# EAGLE design Varella_Feature_Board v.1.0 (EAGLE 9.4.2)
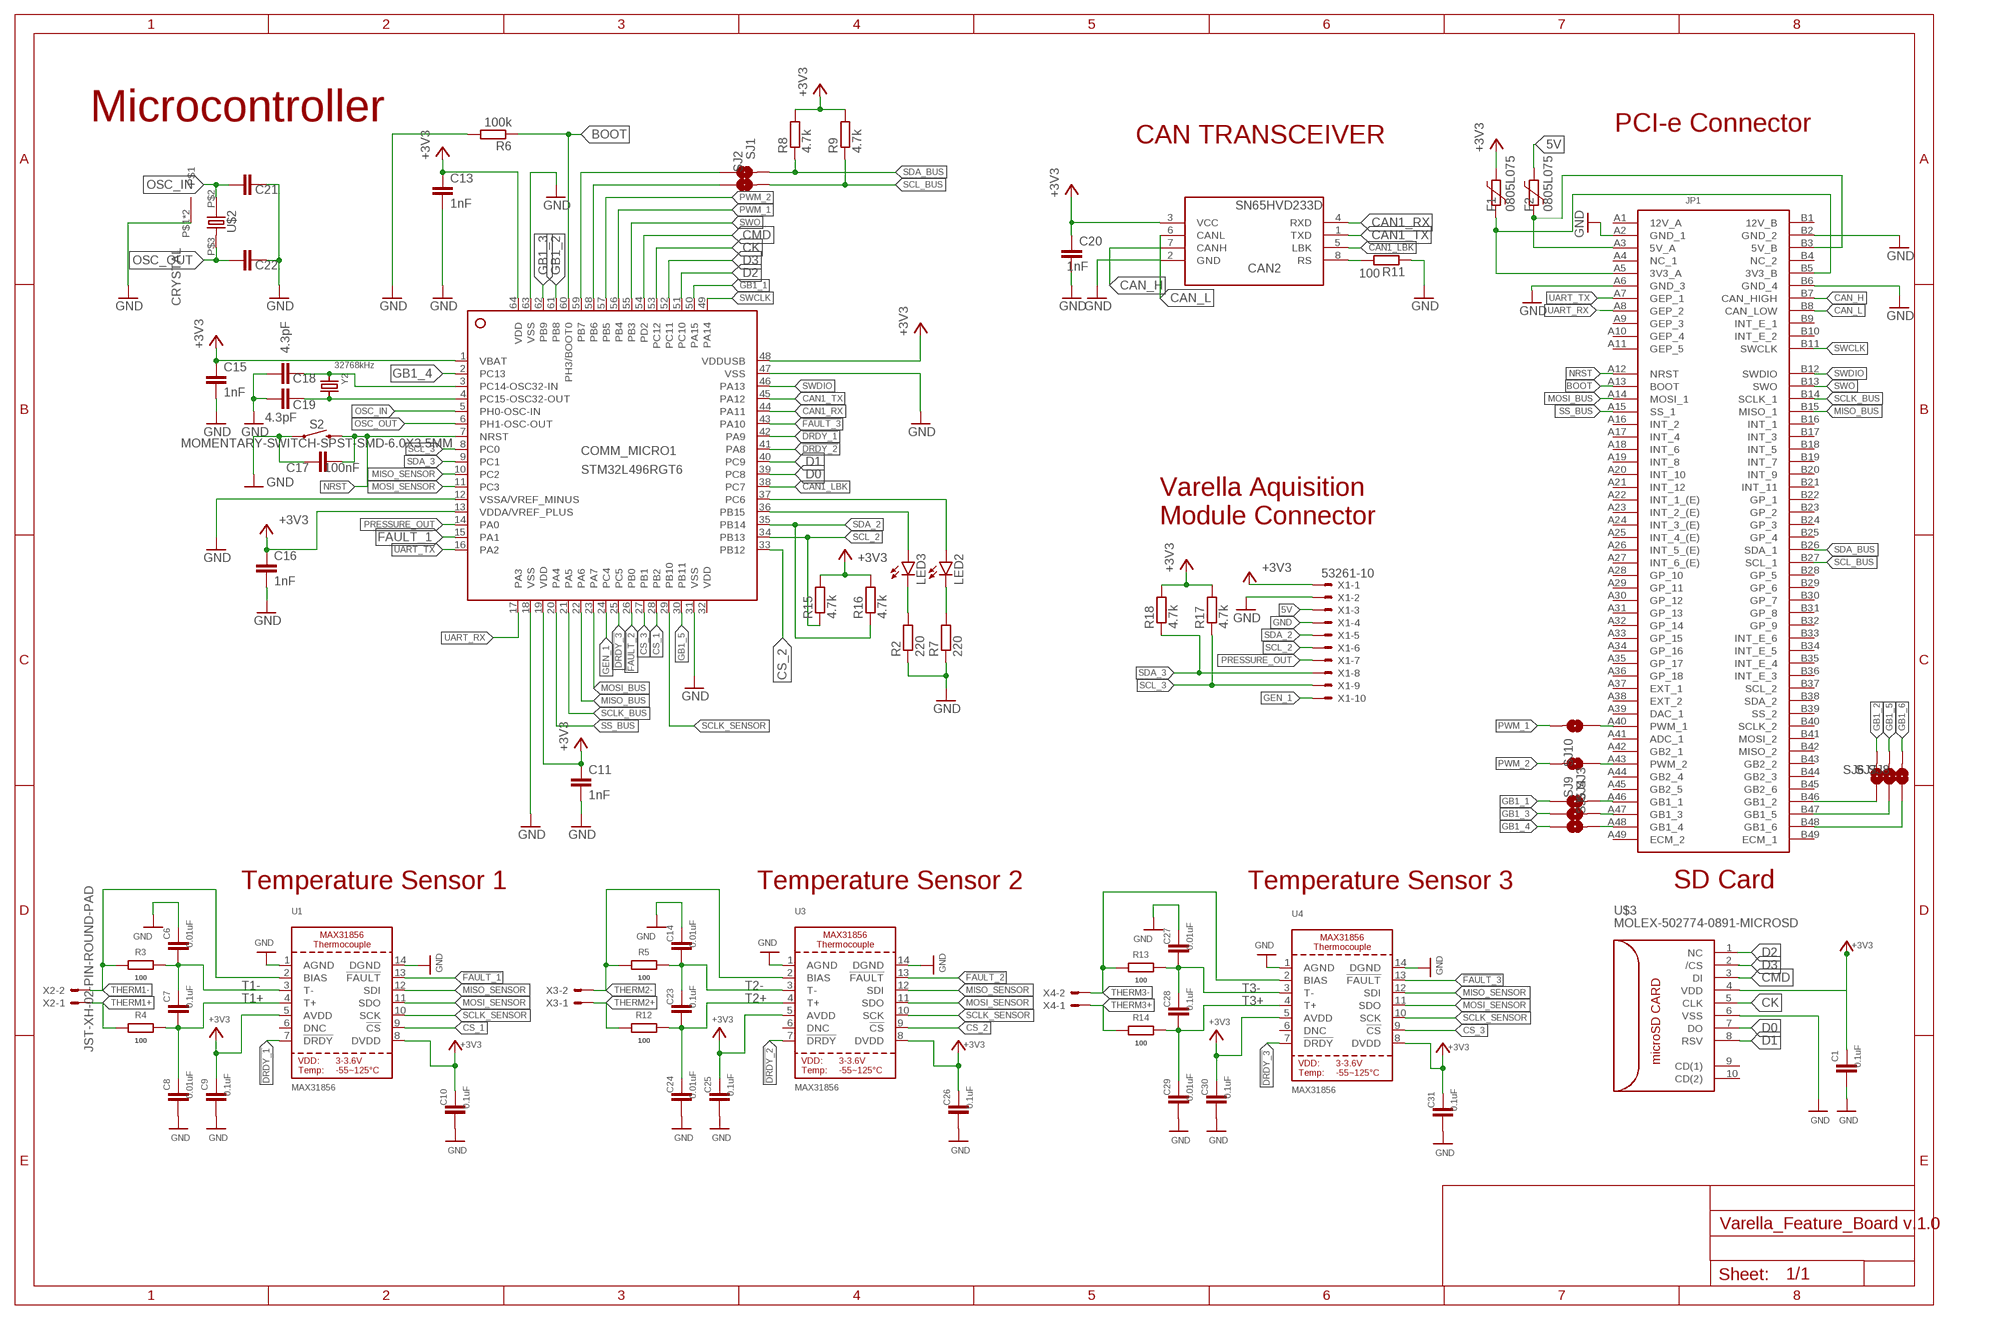
[diagram p0: schematic, sheet 1]

## Parts
C1  0.1uF  C-EUC0805  [C0805]
C6  0.01uF  C-EUC0805  [C0805]
C7  0.1uF  C-EUC0805  [C0805]
C8  0.01uF  C-EUC0805  [C0805]
C9  0.1uF  C-EUC0805  [C0805]
C10  0.1uF  C-EUC0805  [C0805]
C11  1nF  C-EUC0805  [C0805]
C13  1nF  C-EUC0805  [C0805]
C14  0.01uF  C-EUC0805  [C0805]
C15  1nF  C-EUC0805  [C0805]
C16  1nF  C-EUC0805  [C0805]
C17  100nF  C-EUC0805  [C0805]
C18  4.3pF  C-EUC0805  [C0805]
C19  4.3pF  C-EUC0805  [C0805]
C20  1nF  C-EUC0805  [C0805]
C21  C-EUC0805  [C0805]
C22  C-EUC0805  [C0805]
C23  0.1uF  C-EUC0805  [C0805]
C24  0.01uF  C-EUC0805  [C0805]
C25  0.1uF  C-EUC0805  [C0805]
C26  0.1uF  C-EUC0805  [C0805]
C27  0.01uF  C-EUC0805  [C0805]
C28  0.1uF  C-EUC0805  [C0805]
C29  0.01uF  C-EUC0805  [C0805]
C30  0.1uF  C-EUC0805  [C0805]
C31  0.1uF  C-EUC0805  [C0805]
CAN2  SN65HVD233D  [SOIC8]
COMM_MICRO1  STM32L496RGT6  [LQFP64_10X10]
F1  0805L075  [0805L]
F2  0805L075  [0805L]
JP1  FEATURE_BOARD  [PCI-E_164_EDGE]
LED2  LEDCHIP-LED0805  [CHIP-LED0805]
LED3  LEDCHIP-LED0805  [CHIP-LED0805]
R2  220  R-EU_R0805  [R0805]
R3  100  R-EU_R0805  [R0805]
R4  100  R-EU_R0805  [R0805]
R5  100  R-EU_R0805  [R0805]
R6  100k  R-EU_R0805  [R0805]
R7  220  R-EU_R0805  [R0805]
R8  4.7k  R-EU_R0805  [R0805]
R9  4.7k  R-EU_R0805  [R0805]
R11  100  R-EU_R0805  [R0805]
R12  100  R-EU_R0805  [R0805]
R13  100  R-EU_R0805  [R0805]
R14  100  R-EU_R0805  [R0805]
R15  4.7k  R-EU_R0805  [R0805]
R16  4.7k  R-EU_R0805  [R0805]
R17  4.7k  R-EU_R0805  [R0805]
R18  4.7k  R-EU_R0805  [R0805]
S2  MOMENTARY-SWITCH-SPST-SMD-6.0X3.5MM  [TACTILE_SWITCH_SMD_6.0X3.5MM]
SJ1  SMD-JUMPER-2  [SMD-JUMPER-2]
SJ2  SMD-JUMPER-2  [SMD-JUMPER-2]
SJ3  SMD-JUMPER-2  [SMD-JUMPER-2]
SJ4  SMD-JUMPER-2  [SMD-JUMPER-2]
SJ5  SMD-JUMPER-2  [SMD-JUMPER-2]
SJ6  SMD-JUMPER-2  [SMD-JUMPER-2]
SJ7  SMD-JUMPER-2  [SMD-JUMPER-2]
SJ8  SMD-JUMPER-2  [SMD-JUMPER-2]
SJ9  SMD-JUMPER-2  [SMD-JUMPER-2]
SJ10  SMD-JUMPER-2  [SMD-JUMPER-2]
U1  MAX31856  [TSSOP14]
U3  MAX31856  [TSSOP14]
U4  MAX31856  [TSSOP14]
U$2  CRYSTAL  [CRYSTAL_SMD]
U$3  MOLEX-502774-0891-MICROSD  [MOLEX-502774-0891-MICROSD]
X1  53261-10  [53261-10]
X2  JST-XH-02-PIN-ROUND-PAD  [JST-XH-02-PACKAGE-ROUND-PAD]
X3  JST-XH-02-PIN-ROUND-PAD  [JST-XH-02-PACKAGE-ROUND-PAD]
X4  JST-XH-02-PIN-ROUND-PAD  [JST-XH-02-PACKAGE-ROUND-PAD]
Y2  32768kHz  CRYSTAL8X3.8SMT  [CRYSTAL_8X3.8]

## Nets
3.3V: C9.1 C10.1 C25.1 C26.1 C30.1 C31.1 U1.5(AVDD) U1.8(DVDD) U3.5(AVDD) U3.8(DVDD) U4.5(AVDD) U4.8(DVDD) ; supply symbol labelled +3V3
5V: F2.1 X1.3
!DRDY_1: COMM_MICRO1.42(PA9) U1.7(!DRDY)
!DRDY_2: COMM_MICRO1.41(PA8) U3.7(!DRDY)
!DRDY_3: COMM_MICRO1.25(PC5) U4.7(!DRDY)
!FAULT_1: COMM_MICRO1.15(PA1) U1.13(!FAULT)
!FAULT_2: COMM_MICRO1.26(PB0) U3.13(!FAULT)
!FAULT_3: COMM_MICRO1.43(PA10) U4.13(!FAULT)
+3V3: C1.1 C11.1 C13.1 C15.1 C16.1 C20.1 CAN2.3(VCC) COMM_MICRO1.1(VBAT) COMM_MICRO1.13(VDDA/VREF_PLUS) COMM_MICRO1.19(VDD) COMM_MICRO1.48(VDDUSB) COMM_MICRO1.64(VDD) F1.1 R8.2 R9.2 R15.2 R16.2 R17.2 R18.2 U$3.4(VDD) X1.1
BOOT: COMM_MICRO1.60(PH3/BOOT0) JP1.A13(BOOT) R6.1
CAN1_LBK: CAN2.5(LBK) COMM_MICRO1.38(PC7)
CAN1_RX: CAN2.4(RXD) COMM_MICRO1.44(PA11)
CAN1_TX: CAN2.1(TXD) COMM_MICRO1.45(PA12)
CAN_H: CAN2.7(CANH) JP1.B7(CAN_HIGH)
CAN_L: CAN2.6(CANL) JP1.B8(CAN_LOW)
CK: COMM_MICRO1.53(PC12) U$3.5(CLK)
CMD: COMM_MICRO1.54(PD2) U$3.3(DI)
CS_1: COMM_MICRO1.28(PB2) U1.9(!CS)
CS_2: COMM_MICRO1.33(PB12) U3.9(!CS)
CS_3: COMM_MICRO1.27(PB1) U4.9(!CS)
D0: COMM_MICRO1.39(PC8) U$3.7(DO)
D1: COMM_MICRO1.40(PC9) U$3.8(RSV)
D2: COMM_MICRO1.51(PC10) U$3.1(NC)
D3: COMM_MICRO1.52(PC11) U$3.2(/CS)
GB1_1: COMM_MICRO1.50(PA15) SJ3.1
GB1_2: COMM_MICRO1.61(PB8) SJ6.2
GB1_3: COMM_MICRO1.62(PB9) SJ4.1
GB1_4: COMM_MICRO1.2(PC13) SJ5.1
GB1_5: COMM_MICRO1.30(PB11) SJ7.2
GB1_6: SJ8.2
GEN_1: COMM_MICRO1.24(PC4) X1.10
GND: C1.2 C6.1 C8.2 C9.2 C10.2 C11.2 C13.2 C14.1 C15.2 C16.2 C17.1 C18.1 C19.1 C20.2 C21.2 C22.2 C24.2 C25.2 C26.2 C27.1 C29.2 C30.2 C31.2 CAN2.2(GND) COMM_MICRO1.12(VSSA/VREF_MINUS) COMM_MICRO1.18(VSS) COMM_MICRO1.31(VSS) COMM_MICRO1.47(VSS) COMM_MICRO1.63(VSS) JP1.A2(GND_1) JP1.A6(GND_3) JP1.B2(GND_2) R2.1 R6.2 R7.1 R11.1 S2.1 U1.1(AGND) U1.14(DGND) U3.1(AGND) U3.14(DGND) U4.1(AGND) U4.14(DGND) U$2.P$1 U$2.P$4 U$3.6(VSS) X1.2 X1.4
GND(6): JP1.B6(GND_4) ; supply symbol labelled GND
MISO_BUS: COMM_MICRO1.22(PA6) JP1.B15(MISO_1)
MISO_SENSOR: COMM_MICRO1.10(PC2) U1.12(SDI) U3.12(SDI) U4.12(SDI)
MOSI_BUS: COMM_MICRO1.23(PA7) JP1.A14(MOSI_1)
MOSI_SENSOR: COMM_MICRO1.11(PC3) U1.11(SDO) U3.11(SDO) U4.11(SDO)
N$1: JP1.A40(PWM_1) JP1.A43(PWM_2) SJ9.1 SJ10.1
N$2: JP1.A47(GB1_3) SJ4.2
N$3: COMM_MICRO1.36(PB15) LED3.A
N$4: LED3.C R2.2
N$5: F2.2 JP1.A3(5V_A) JP1.B3(5V_B)
N$6: COMM_MICRO1.37(PC6) LED2.A
N$7: LED2.C R7.2
N$8: F1.2 JP1.A5(3V3_A) JP1.B5(3V3_B)
N$9: JP1.B46(GB1_2) SJ6.1
N$10: C18.2 COMM_MICRO1.3(PC14-OSC32-IN) Y2.P$1
N$11: C19.2 COMM_MICRO1.4(PC15-OSC32-OUT) Y2.P$4
N$12: COMM_MICRO1.59(PB7) SJ1.1
N$13: COMM_MICRO1.58(PB6) SJ2.1
N$14: CAN2.8(RS) R11.2
N$15: JP1.B47(GB1_5) SJ7.1
N$16: JP1.B48(GB1_6) SJ8.1
N$17: JP1.A48(GB1_4) SJ5.2
N$20: JP1.A46(GB1_1) SJ3.2
NRST: C17.2 COMM_MICRO1.7(NRST) JP1.A12(NRST) S2.2
OSC_IN: C21.1 COMM_MICRO1.5(PH0-OSC-IN) U$2.P$2
OSC_OUT: C22.1 COMM_MICRO1.6(PH1-OSC-OUT) U$2.P$3
PRESSURE_OUT: COMM_MICRO1.14(PA0) X1.7
PWM_1: COMM_MICRO1.56(PB4) SJ10.2
PWM_2: COMM_MICRO1.57(PB5) SJ9.2
SCL_2: COMM_MICRO1.34(PB13) R15.1 X1.6
SCL_3: COMM_MICRO1.8(PC0) R17.1 X1.9
SCL_BUS: JP1.B27(SCL_1) R9.1 SJ2.2
SCLK_BUS: COMM_MICRO1.21(PA5) JP1.B14(SCLK_1)
SCLK_SENSOR: COMM_MICRO1.29(PB10) U1.10(SCK) U3.10(SCK) U4.10(SCK)
SDA_2: COMM_MICRO1.35(PB14) R16.1 X1.5
SDA_3: COMM_MICRO1.9(PC1) R18.1 X1.8
SDA_BUS: JP1.B26(SDA_1) R8.1 SJ1.2
SS_BUS: COMM_MICRO1.20(PA4) JP1.A15(SS_1)
SWCLK: COMM_MICRO1.49(PA14) JP1.B11(SWCLK)
SWDIO: COMM_MICRO1.46(PA13) JP1.B12(SWDIO)
SWO: COMM_MICRO1.55(PB3) JP1.B13(SWO)
T1+: C7.2 C8.1 R4.2 U1.4(T+)
T1-: C6.2 C7.1 R3.2 U1.3(T-)
T2+: C23.2 C24.1 R12.2 U3.4(T+)
T2-: C14.2 C23.1 R5.2 U3.3(T-)
T3+: C28.2 C29.1 R14.2 U4.4(T+)
T3-: C27.2 C28.1 R13.2 U4.3(T-)
THERM1+: R4.1 X2.1
THERM1-: R3.1 U1.2(BIAS) X2.2
THERM2+: R12.1 X3.1
THERM2-: R5.1 U3.2(BIAS) X3.2
THERM3+: R14.1 X4.1
THERM3-: R13.1 U4.2(BIAS) X4.2
UART_RX: COMM_MICRO1.17(PA3) JP1.A8(GEP_2)
UART_TX: COMM_MICRO1.16(PA2) JP1.A7(GEP_1)
Unconnected: JP1.A4(NC_1) JP1.A9(GEP_3) JP1.A10(GEP_4) JP1.A11(GEP_5) JP1.A16(INT_2) JP1.A17(INT_4) JP1.A18(INT_6) JP1.A19(INT_8) JP1.A20(INT_10) JP1.A21(INT_12) JP1.A22(INT_1_(E)) JP1.A23(INT_2_(E)) JP1.A24(INT_3_(E)) JP1.A25(INT_4_(E)) JP1.A26(INT_5_(E)) JP1.A27(INT_6_(E)) JP1.A28(GP_10) JP1.A29(GP_11) JP1.A30(GP_12) JP1.A31(GP_13) JP1.A32(GP_14) JP1.A33(GP_15) JP1.A34(GP_16) JP1.A35(GP_17) JP1.A36(GP_18) JP1.A37(EXT_1) JP1.A38(EXT_2) JP1.A39(DAC_1) JP1.A41(ADC_1) JP1.A42(GB2_1) JP1.A44(GB2_4) JP1.A45(GB2_5) JP1.A49(ECM_2) JP1.B4(NC_2) JP1.B9(INT_E_1) JP1.B10(INT_E_2) JP1.B16(INT_1) JP1.B17(INT_3) JP1.B18(INT_5) JP1.B19(INT_7) JP1.B20(INT_9) JP1.B21(INT_11) JP1.B22(GP_1) JP1.B23(GP_2) JP1.B24(GP_3) JP1.B25(GP_4) JP1.B28(GP_5) JP1.B29(GP_6) JP1.B30(GP_7) JP1.B31(GP_8) JP1.B32(GP_9) JP1.B33(INT_E_6) JP1.B34(INT_E_5) JP1.B35(INT_E_4) JP1.B36(INT_E_3) JP1.B37(SCL_2) JP1.B38(SDA_2) JP1.B39(SS_2) JP1.B40(SCLK_2) JP1.B41(MOSI_2) JP1.B42(MISO_2) JP1.B43(GB2_2) JP1.B44(GB2_3) JP1.B45(GB2_6) JP1.B49(ECM_1) U1.6(DNC) U3.6(DNC) U4.6(DNC) U$3.9(CD(1)) U$3.10(CD(2))

## Notes on the sheet
- Microcontroller
- CAN TRANSCEIVER | PCI-e Connector
- Varella Aquisition 
  Module Connector
- Temperature Sensor 1 | Temperature Sensor 2 | Temperature Sensor 3 | SD Card

## Power pins joined to a net without a drawn wire
12V_A: JP1.A1(12V_A)
12V_B: JP1.B1(12V_B)
VDD: COMM_MICRO1.32(VDD)

## Library data of the parts
C1 C6-C11 C13-C31 = rcl:C-EU: CAPACITOR, European symbol; SPICEPREFIX: C
CAN2 = SN65HVD233D:SN65HVD233D; AVAILABILITY: Unavailable; DESCRIPTION: 3.3V CAN Transceiver with Standby Mode, Loop-back 8-SOIC -40 to 125; MF: Texas Instruments; MP: SN65HVD233D; PACKAGE: SOIC-8 Texas Instruments; PRICE: None
COMM_MICRO1 = STM32L4xxx:STM32L496R*: STM32L496RX LQFP64 Cortex M4, 80MHz, 512kB-1024kB Flash, 320kB SRAM Datasheet STM32L496XX <http://www.st.com/content/ccc/resource/technical/document/datasheet/group3/3f/73/19/d1/d4/9e/48/34/DM00284211/files/DM00284211.pdf/jcr:content/translations/en.DM00284211.pdf>; FARNELL: 2725138; FLASH: 1024kB; SRAM: 320kB
F1 F2 = polyfuse-smd_10:?: Polyfuse Resettable PTC Source: http://www.littelfuse.com/products/resettable-ptcs.aspx; MF: Littelfuse; MPN: 0805L075; OC_FARNELL: 1832105RL; OC_NEWARK: 18M4777
JP1 = Genus_Feature_Board:FEATURE_BOARD
LED2 LED3 = led:LED: LED OSRAM: - CHIPLED LG R971, LG N971, LY N971, LG Q971, LY Q971, LO R971, LY R971 LH N974, LH R974 LS Q976, LO Q976, LY Q976 LO Q996 - Hyper CHIPLED LW Q18S LB Q993, LB Q99A, LB R99A - SideLED LS A670, LO A670, LY A670, LG A670, LP A670 LB A673, LV A673, LT A673, LW A673 LH A674 LY A675 LS A676, LA A676, LO A676, LY A676, LW A676 LS A679, LY A679, LG A679 - Hyper Micro SIDELED® LS Y876, LA Y876, LO Y876, LY Y876 LT Y87S - SmartLED LW L88C, LW L88S LB L89C, LB L89S, LG L890 LS L89K, LO L89K, LY L89K LS L896, LA L896, LO L896, LY L896 - TOPLED LS T670, LO T670, LY T670, LG T670, LP T670 LSG T670, LSP T670, LSY T670, LOP T670, LYG T670 LG T671, LOG T671, LSG T671 LB T673, LV T673, LT T673, LW T673 LH T674 LS T676, LA T676, LO T676, LY T676, LB T676, LH T676, LSB T676, LW T676 LB T67C, LV T67C, LT T67C, LS T67K, LO T67K, LY T67K, LW E67C LS E67B, LA E67B, LO E67B, LY E67B, LB E67C, LV E67C, LT E67C LW T67C LS T679, LY T679, LG T679 LS T770, LO T770, LY T770, LG T770, LP T770 LB T773, LV T773, LT T773, LW T773 LH T774 LS E675, LA E675, LY E675, LS T675 LS T776, LA T776, LO T776, LY T776, LB T776 LHGB T686 LT T68C, LB T68C - Hyper Mini TOPLED® LB M676 - Mini TOPLED Santana® LG M470 LS M47K, LO M47K, LY M47K Source: http://www.osram.convergy.de LUXEON: - LUMILED® LXK2-PW12-R00, LXK2-PW12-S00, LXK2-PW14-U00, LXK2-PW14-V00 LXK2-PM12-R00, LXK2-PM12-S00, LXK2-PM14-U00 LXK2-PE12-Q00, LXK2-PE12-R00, LXK2-PE12-S00, LXK2-PE14-T00, LXK2-PE14-U00 LXK2-PB12-K00, LXK2-PB12-L00, LXK2-PB12-M00, LXK2-PB14-N00, LXK2-PB14-P00, LXK2-PB14-Q00 LXK2-PR12-L00, LXK2-PR12-M00, LXK2-PR14-Q00, LXK2-PR14-R00 LXK2-PD12-Q00, LXK2-PD12-R00, LXK2-PD12-S00 LXK2-PH12-R00, LXK2-PH12-S00 LXK2-PL12-P00, LXK2-PL12-Q00, LXK2-PL12-R00 Source: www.luxeon.com KINGBRIGHT: KA-3528ASYC Source: www.kingbright.com
R2-R9 R11-R18 = rcl:R-EU_: RESISTOR, European symbol; SPICEPREFIX: R
S2 = SparkFun-Switches:MOMENTARY-SWITCH-SPST: Momentary Switch (Pushbutton) - SPST Normally-open (NO) SPST momentary switches (buttons, pushbuttons). Variants PTH-12MM - 12mm square, through-hole Momentary Pushbutton Switch - 12mm Square <https://www.sparkfun.com/products/9190> (COM-09190) PTH-6.0MM, PTH-6.0MM-KIT - 6.0mm square, through-hole Mini Pushbutton Switch <https://www.sparkfun.com/products/97> (COM-00097) KIT package intended for soldering kit's - only one side of pads' copper is exposed. PTH-RIGHT-ANGLE-KIT - Right-angle, through-hole Right Angle Tactile Button <https://www.sparkfun.com/products/10791> - Used on SparkFun BigTime Watch Kit <https://www.sparkfun.com/products/11734> SMD-12MM - 12mm square, surface-mount Tactile Button - SMD (12mm) <https://www.sparkfun.com/products/12993> (COM-12993) Used on SparkFun PicoBoard <https://www.sparkfun.com/products/11888> SMD-4.5MM - 4.5mm Square Trackball Switch Used on SparkFun Blackberry Trackballer Breakout <https://www.sparkfun.com/products/13169> SMD-4.6MMX2.8MM - 4.60mm x 2.80mm, surface mount Used on SparkFun SAMD21 Mini Breakout <https://www.sparkfun.com/products/13664> SMD-5.2MM, SMD-5.2-REDUNDANT - 5.2mm square, surface-mount Mini Pushbutton Switch - SMD <https://www.sparkfun.com/products/8720> (COM-08720) Used on Arduino Pro Mini <https://www.sparkfun.com/products/11114> REDUNDANT package connects both switch circuits together SMD-6.0X3.5MM - 6.0 x 3.5mm, surface mount Momentary Reset Switch SMD <https://www.sparkfun.com/products/8229> (COM-08229) SMD-6.2MM-TALL - 6.2mm square, surface mount Tactile Button - SMD (6mm) <https://www.sparkfun.com/products/12992> Used on SparkFun Digital Sandbox <https://www.sparkfun.com/products/12651> SMD-RIGHT-ANGLE - Right-angle, surface mount Used on SparkFun Block for Intel® Edison - Arduino <https://www.sparkfun.com/products/13036>; PROD_ID: SWCH-00815; SF_SKU: COM-08229
SJ1-SJ10 = FaBo-PIN:SMD-JUMPER-2
U1 U3 U4 = microbuilder:MAX31856: MAX31856 - Thermocouple Sensor ADC
U$2 = cristal:CRYSTAL
U$3 = Ava:MOLEX-502774-0891-MICROSD; FARNELL: 2064063
X1 = con-zenith:53?-10: CONNECTOR wire to board 1.25 mm (.049 inch) pitch header; MF: MOLEX; OC_FARNELL: unknown; OC_NEWARK: unknown
X2-X4 = JST-XH-Zenith:JST-XH-02-PIN: JST XH Connector 2 Pin Wire to board connector. Pitch: 2,54 mm, (0.100") Number of pins: 2 Created by Rembrandt Electronics www.rembrandtelectronics.com
Y2 = microbuilder:CRYSTAL: Crystals HC49UP - Surface Mount Crystal 4.0MHz 18pF +/-30ppm Surface Mount Crystal [Digikey: 535-9857-1-ND] 12.0 MHz Surface Mount Crystal [Digikey: 535-9869-6-ND] 25.0 MHz Surface Mount Crystal [Digikey: 535-9078-1-ND] 2.5 x 2.0mm - MEMs SMT Crystal 16.0 MHz 10pF 20ppm 2.5 x 2.0mm Crystal [Digikey -40-85°C: 535-10923-1-ND] 3.2 x 2.5mm - MEMs SMT Crystal 12.0 MHz 8pF 15ppm 3.2 x 2.5mm Crystal [Digikey: -10-70°C: 644-1047-1-ND -40-125°C: 644-1128-1-ND] 16.0 MHz 8pF 15ppm 3.2 x 2.5mm Crystal [Digikey: -10-70°C: 644-1049-1-ND -40-125°C: 644-1129-2-ND] 16.0 MHz 10pF 10ppm 3.2 x 2.5mm Crystal [Digikey: 644-1100-1-ND] 27.12 MHz 18pF 30ppm 3.2 x 2.5mm Crystal [Digikey: 887-1424-1-ND] 27.12MHz 10pF 10ppm 3.2 x 2.5mm Crystal [Digikey: 887-1329-1-ND] 4.9 x 1.8mm - MEMs SMT Crystal 32.768 KHz 12.5pF 20ppm 4.9 x 1.8mm Crystal [Digikey: SE2415CT-ND] 8.0 x 3.8mm - Surface Mount Crystal 32.768kHz 12.5pF 20ppm -40°C-85°C [Digikey: 535-9166-2-ND] Cylinder 32.768KHz Cylinder Crystal (2x6mm body) [Ex. Digikey: 300-8341-2-ND]

## Board
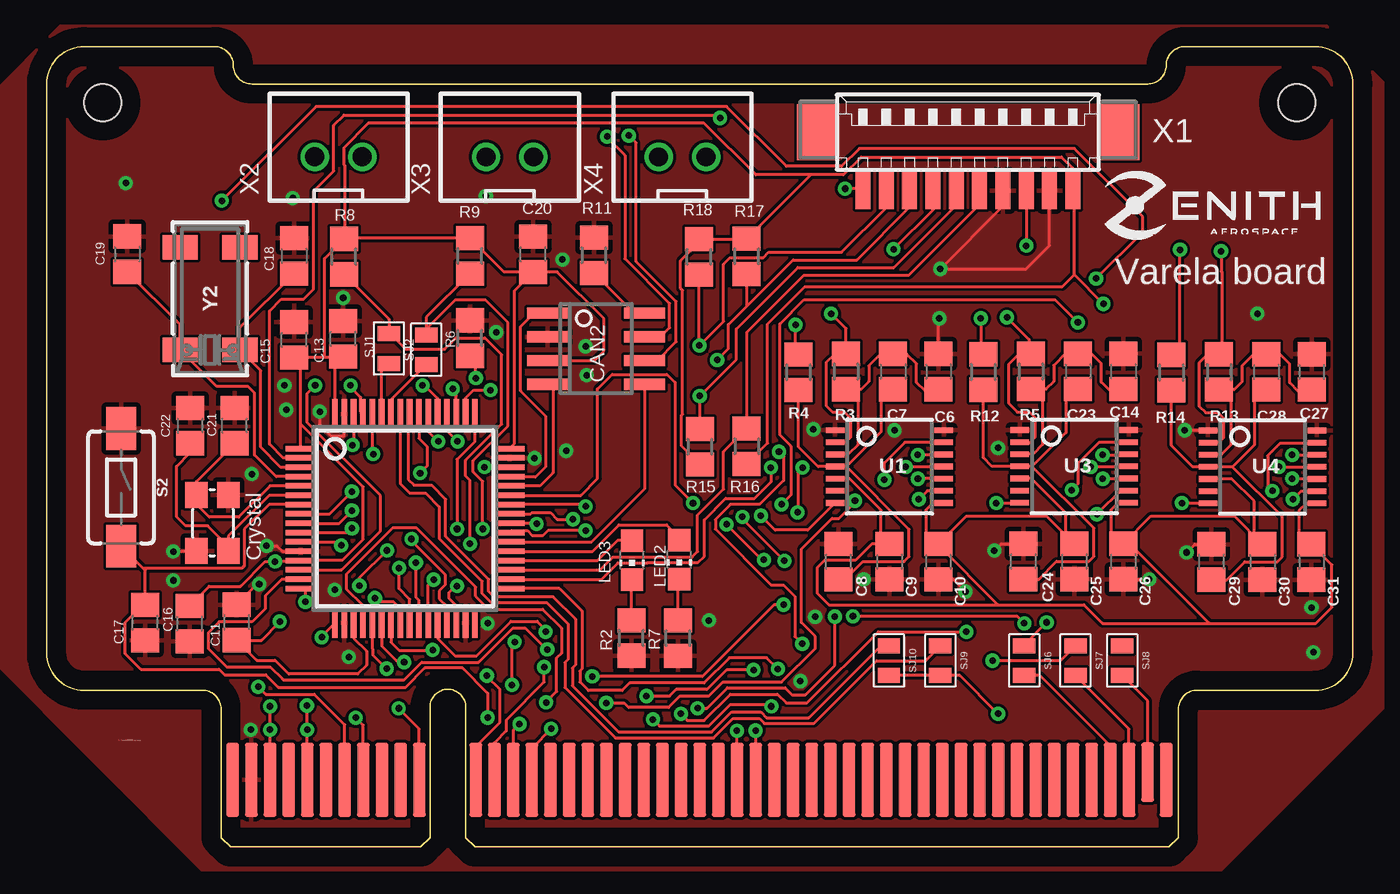
[diagram p1: board, top side]
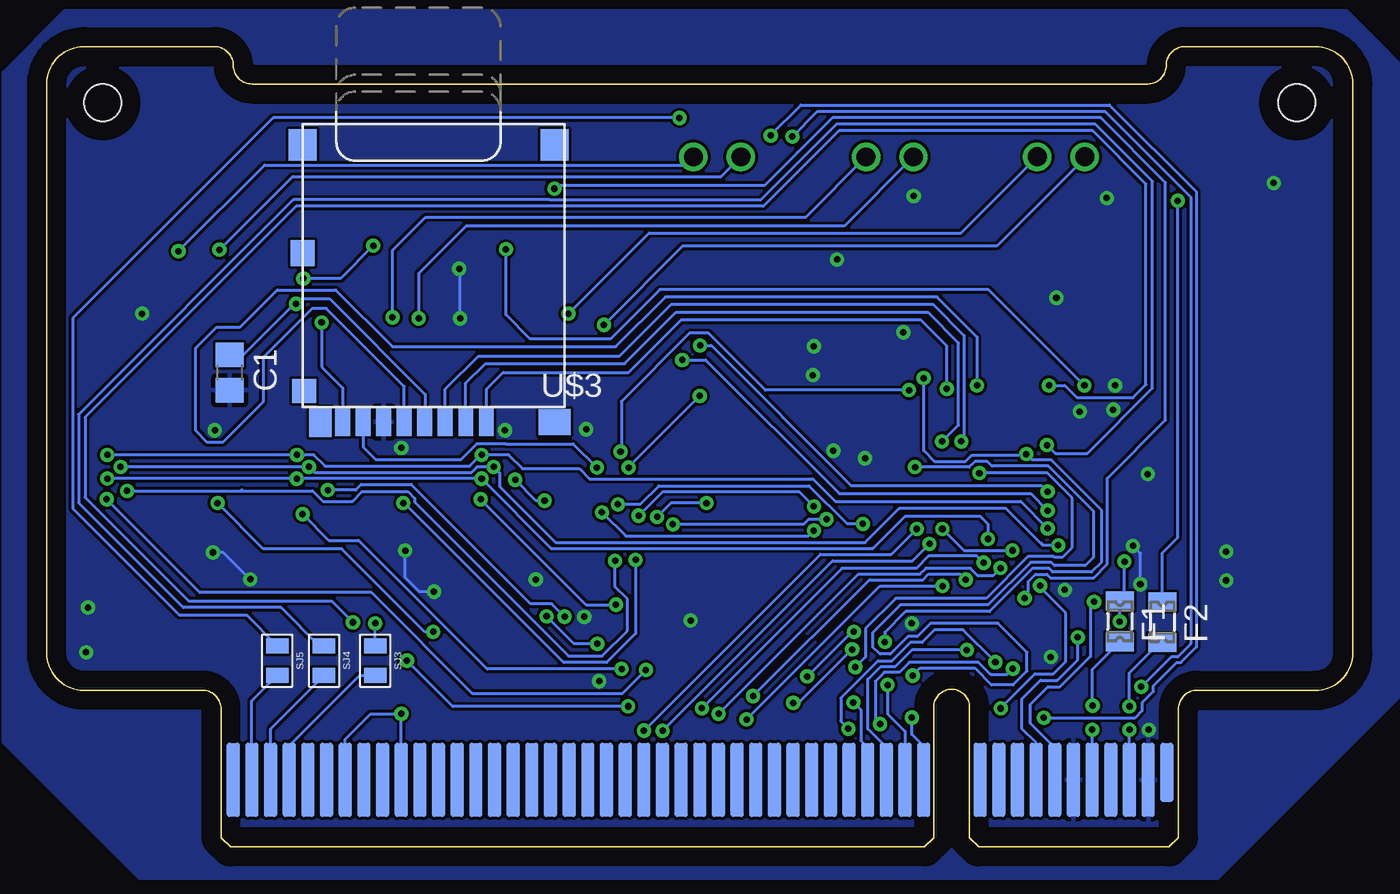
[diagram p2: board, bottom side, seen from below]

Size 70 x 42.9 mm. Coordinates in mm from the lower left corner, seen from the top.
Copper layers (1*16): Top 0.035mm / dielectric 1.5mm / Bottom 0.035mm
Design rules "default": minimum track width 6mil, minimum drill 0.35mm, track to track 6mil, track to pad 6mil, pad to pad 6mil, via to via 6mil, smd to smd 6mil, copper to edge 40mil, drill to drill 6mil, minimum pad ring 10mil, minimum via ring 8mil, stop-mask expansion 4mil, vias tented up to drill 0mil, thermal gap 10mil

### Footprints (pad centres in the part's own frame; a part is rotated, then mirrored left to right if it is on the bottom)
C0805 = smd 1.3 x 1.5: 1 -0.95,0; 2 0.95,0
SOIC8 = smd 0.6 x 2.2: 1 -1.905,-2.6; 2 -0.635,-2.6; 3 0.635,-2.6; 4 1.905,-2.6; 5 1.905,2.6; 6 0.635,2.6; 7 -0.635,2.6; 8 -1.905,2.6
LQFP64_10X10 = smd 0.3 x 1.6: 1 -3.75,-5.6; 2 -3.25,-5.6; 3 -2.75,-5.6; 4 -2.25,-5.6; 5 -1.75,-5.6; 6 -1.25,-5.6; 7 -0.75,-5.6; 8 -0.25,-5.6; 9 0.25,-5.6; 10 0.75,-5.6; 11 1.25,-5.6; 12 1.75,-5.6; 13 2.25,-5.6; 14 2.75,-5.6; 15 3.25,-5.6; 16 3.75,-5.6; 33 3.75,5.6; 34 3.25,5.6; 35 2.75,5.6; 36 2.25,5.6; 37 1.75,5.6; 38 1.25,5.6; 39 0.75,5.6; 40 0.25,5.6; 41 -0.25,5.6; 42 -0.75,5.6; 43 -1.25,5.6; 44 -1.75,5.6; 45 -2.25,5.6; 46 -2.75,5.6; 47 -3.25,5.6; 48 -3.75,5.6 | smd 1.6 x 0.3: 17 5.6,-3.75; 18 5.6,-3.25; 19 5.6,-2.75; 20 5.6,-2.25; 21 5.6,-1.75; 22 5.6,-1.25; 23 5.6,-0.75; 24 5.6,-0.25; 25 5.6,0.25; 26 5.6,0.75; 27 5.6,1.25; 28 5.6,1.75; 29 5.6,2.25; 30 5.6,2.75; 31 5.6,3.25; 32 5.6,3.75; 49 -5.6,3.75; 50 -5.6,3.25; 51 -5.6,2.75; 52 -5.6,2.25; 53 -5.6,1.75; 54 -5.6,1.25; 55 -5.6,0.75; 56 -5.6,0.25; 57 -5.6,-0.25; 58 -5.6,-0.75; 59 -5.6,-1.25; 60 -5.6,-1.75; 61 -5.6,-2.25; 62 -5.6,-2.75; 63 -5.6,-3.25; 64 -5.6,-3.75
0805L = smd 1 x 1.5: 1 -1.1,0; 2 1.1,0
PCI-E_164_EDGE = smd 0.7 x 3.2 bottom: A1 0.62,4 | smd 0.7 x 4 bottom: A2 1.62,3.6; A3 2.62,3.6; A4 3.62,3.6; A5 4.62,3.6; A6 5.62,3.6; A7 6.62,3.6; A8 7.62,3.6; A9 8.62,3.6; A10 9.62,3.6; A11 10.62,3.6; A12 13.65,3.6; A13 14.65,3.6; A14 15.65,3.6; A15 16.65,3.6; A16 17.65,3.6; A17 18.65,3.6; A18 19.65,3.6; A19 20.65,3.6; A20 21.65,3.6; A21 22.65,3.6; A22 23.65,3.6; A23 24.65,3.6; A24 25.65,3.6; A25 26.65,3.6; A26 27.65,3.6; A27 28.65,3.6; A28 29.65,3.6; A29 30.65,3.6; A30 31.65,3.6; A31 32.65,3.6; A32 33.65,3.6; A33 34.65,3.6; A34 35.65,3.6; A35 36.65,3.6; A36 37.65,3.6; A37 38.65,3.6; A38 39.65,3.6; A39 40.65,3.6; A40 41.65,3.6; A41 42.65,3.6; A42 43.65,3.6; A43 44.65,3.6; A44 45.65,3.6; A45 46.65,3.6; A46 47.65,3.6; A47 48.65,3.6; A48 49.65,3.6; A49 50.65,3.6 | smd 0.7 x 4: B1 0.62,3.6; B2 1.62,3.6; B3 2.62,3.6; B4 3.62,3.6; B5 4.62,3.6; B6 5.62,3.6; B7 6.62,3.6; B8 7.62,3.6; B9 8.62,3.6; B10 9.62,3.6; B11 10.62,3.6; B12 13.65,3.6; B13 14.65,3.6; B14 15.65,3.6; B15 16.65,3.6; B16 17.65,3.6; B17 18.65,3.6; B18 19.65,3.6; B19 20.65,3.6; B20 21.65,3.6; B21 22.65,3.6; B22 23.65,3.6; B23 24.65,3.6; B24 25.65,3.6; B25 26.65,3.6; B26 27.65,3.6; B27 28.65,3.6; B28 29.65,3.6; B29 30.65,3.6; B30 31.65,3.6; B31 32.65,3.6; B32 33.65,3.6; B33 34.65,3.6; B34 35.65,3.6; B35 36.65,3.6; B36 37.65,3.6; B37 38.65,3.6; B38 39.65,3.6; B39 40.65,3.6; B40 41.65,3.6; B41 42.65,3.6; B42 43.65,3.6; B43 44.65,3.6; B44 45.65,3.6; B45 46.65,3.6; B46 47.65,3.6; B47 48.65,3.6; B49 50.65,3.6 | smd 0.7 x 3.2: B48 49.65,4.01 | hole 2: -6.35,39.9; 57.65,39.9
CHIP-LED0805 = smd 1.2 x 1.2: A 0,-1.05; C 0,1.05
R0805 = smd 1.3 x 1.5: 1 -0.95,0; 2 0.95,0
TACTILE_SWITCH_SMD_6.0X3.5MM = smd 2.3 x 1.6: 1 -3.15,0; 2 3.15,0
SMD-JUMPER-2 = smd 0.8 x 1.2: 1 -0.8,0; 2 0.8,0
TSSOP14 = smd 0.305 x 0.991: 1 -1.95,-2.918; 2 -1.3,-2.918; 3 -0.65,-2.918; 4 0,-2.918; 5 0.65,-2.918; 6 1.3,-2.918; 7 1.95,-2.918; 8 1.95,2.918; 9 1.3,2.918; 10 0.65,2.918; 11 0,2.918; 12 -0.65,2.918; 13 -1.3,2.918; 14 -1.95,2.918
CRYSTAL_SMD = smd 1.4 x 1.2: P$1 0,1.7; P$2 3,1.7; P$3 0,0; P$4 3,0
MOLEX-502774-0891-MICROSD = smd 0.8 x 1.5: 1 -3.3,8.2; 2 -2.2,8.2; 3 -1.1,8.2; 4 0,8.2; 5 1.1,8.2; 6 2.2,8.2; 7 3.3,8.2; 8 4.4,8.2 | smd 1.29 x 1.3: 9 6.455,6.55 | smd 1.29 x 1.4: 10 6.54,-0.85 | smd 1.5 x 1.7: 11 6.54,-6.65; 12 -6.96,-6.65 | smd 1.7 x 1.4: 14 -6.96,8.2 | smd 1.2 x 1.6: 15 5.6,8.2
53261-10 = smd 0.8 x 2: 1 5.625,-2.5; 2 4.375,-2.5; 3 3.125,-2.5; 4 1.875,-2.5; 5 0.625,-2.5; 6 -0.625,-2.5; 7 -1.875,-2.5; 8 -3.125,-2.5; 9 -4.375,-2.5; 10 -5.625,-2.5 | smd 2.1 x 3: S1 8.125,0.625; S2 -8.125,0.625
JST-XH-02-PACKAGE-ROUND-PAD = drill 1.016: 1 -1.27,0; 2 1.27,0
CRYSTAL_8X3.8 = smd 1.3 x 1.9: P$1 -2.75,-1.6; P$2 2.75,-1.6; P$3 2.75,1.6; P$4 -2.75,1.6

### Placement (x,y rotation side)
C1  60.2,25.43 270 bottom
C6  47.8,25.48 270 top
C7  45.37,25.48 270 top
C8  42.44,15.29 90 top
C9  45.17,15.29 270 top
C10  47.79,15.29 270 top
C11  10.19,12.04 90 top
C13  15.89,27.23 90 top
C14  57.7,25.49 270 top
C15  13.26,27.19 90 top
C16  7.65,11.97 270 top
C17  5.28,12.03 90 top
C18  13.27,31.69 270 top
C19  4.32,31.78 270 top
C20  26.07,31.77 90 top
C21  10.07,22.59 90 top
C22  7.7,22.59 90 top
C23  55.27,25.49 270 top
C24  52.34,15.3 90 top
C25  55.07,15.3 270 top
C26  57.69,15.3 270 top
C27  67.79,25.46 270 top
C28  65.36,25.46 270 top
C29  62.43,15.27 90 top
C30  65.16,15.27 270 top
C31  67.78,15.27 270 top
CAN2  29.45,26.71 270 top
COMM_MICRO1  19.2,17.61 270 top
F1  12.49,12.09 270 bottom
F2  10.21,12.06 270 bottom
JP1  9.35,0 0 top
LED2  33.9,15.4 180 top
LED3  31.37,15.38 180 top
R2  31.33,11.2 90 top
R3  42.84,25.48 270 top
R4  40.28,25.45 270 top
R5  52.74,25.49 270 top
R6  22.68,27.28 90 top
R7  33.84,11.2 90 top
R8  15.93,31.64 90 top
R9  22.68,31.69 90 top
R11  29.32,31.71 270 top
R12  50.19,25.46 270 top
R13  62.83,25.46 270 top
R14  60.27,25.43 270 top
R15  35,21.45 270 top
R16  37.52,21.48 270 top
R17  34.96,31.63 90 top
R18  37.51,31.66 90 top
S2  3.99,19.27 270 top
SJ1  18.34,26.71 90 top
SJ2  20.34,26.65 90 top
SJ3  52.39,9.99 270 bottom
SJ4  55.14,9.99 270 bottom
SJ5  57.64,9.99 270 bottom
SJ6  52.39,9.99 90 top
SJ7  55.14,9.99 90 top
SJ8  57.64,9.99 90 top
SJ9  47.89,9.99 90 top
SJ10  45.14,9.99 90 top
U1  45.17,20.39 270 top
U3  55.07,20.4 270 top
U4  65.16,20.38 270 top
U$2  9.74,15.86 90 top
U$3  49.74,30.99 180 bottom
X1  49.37,37.69 0 top
X2  15.64,37 0 top
X3  24.82,36.99 0 top
X4  34.07,36.99 0 top
Y2  8.76,29.39 90 top

### Tracks (layer width: path | path; a pad name or v marks a point on that pad's centre or on a via)
3.3V
  Top 0.152: U1.5 42.26,19.75 43.02,19.75 44.72,18.05 44.72,16.29 44.77,16.24 C9.1 44.22,16.24 43.34,15.36 41.69,15.36 41.29,14.96 41.29,13.61 41.91,12.99 50.99,12.99 | U1.8 47.51,18.44 47.12,18.05 47.12,16.74 | 47.12,16.74 47.12,16.4 | U3.5 52.16,19.76 52.77,19.76 54.62,17.91 54.62,16.3 54.67,16.25 C25.1 53.59,17.74 49.28,17.74 C10.1 | U3.8 57.41,18.45 57.02,18.06 57.02,16.41 57.18,16.25 C26.1 | U4.5 62.25,19.73 63.51,19.73 64.71,18.54 64.71,16.27 64.76,16.22 C30.1 63.65,17.74 59.18,17.74 C26.1 | U4.8 67.5,18.43 67.11,18.04 67.11,16.89 | 67.11,16.89 67.11,16.38 | C26.1 58.05,16.25 62.31,11.99 | 50.99,12.99 47.79,16.19 C10.1 | 50.99,12.99 55.59,12.99 56.59,11.99 62.31,11.99 | 67.11,16.89 C31.1 68.87,15.13 68.87,12.85 68.01,11.99 62.31,11.99 | C10.1 47.61,16.24 47.12,16.74
5V  (via drill 0.35)
  Top 0.152: X1.3 v52.5,32.23 | 9.34,34.59 v9.39,34.64 14.44,39.69 36.44,39.69 39.64,36.49 42.59,36.49 43.54,37.44 55.09,37.44 58.74,33.79 58.74,32.97 v56.24,30.47
  Bottom 0.152: F2.1 10.21,15.77 9.39,16.59 v9.39,34.64 | v52.5,32.23 54.26,30.47 v56.24,30.47
!DRDY_1  (via drill 0.35)
  Top 0.152: U1.7 40.79,16.99 39.04,16.99 v38.27,17.75 | COMM_MICRO1.42 28.79,18.36 v28.89,18.26
  Bottom 0.152: v38.27,17.75 36.97,19.05 29.69,19.05 v28.89,18.26
!DRDY_2  (via drill 0.35)
  Top 0.152: COMM_MICRO1.41 25.94,17.86 26.01,17.92 27,17.92 27.36,17.57 v28.2,17.57 | v38.44,15.39 38.34,15.39 v36.44,17.29 | v50.89,18.44 50.9,18.45 U3.7
  Bottom 0.152: v28.2,17.57 29.16,17.57 29.44,17.29 v36.44,17.29 | v38.44,15.39 38.44,11.44 39.99,9.89 42.29,9.89 50.84,18.44 v50.89,18.44
!DRDY_3  (via drill 0.35)
  Top 0.152: COMM_MICRO1.25 19.45,13.28 18.88,13.85 v18.88,14.95 | v33.99,7.14 34.34,6.79 35.24,6.79 36.64,8.19 39.16,8.19 39.64,7.71 40.74,7.71 44.56,11.54 v49.29,11.54 | v60.84,18.44 62.23,18.44 U4.7
  Bottom 0.152: v18.88,14.95 19.3,14.54 20.1,14.54 20.49,14.93 22.89,14.93 23.19,14.63 26.49,14.63 v33.99,7.14 | v49.29,11.54 49.74,11.54 54.19,15.99 58.39,15.99 v60.84,18.44
!FAULT_1  (via drill 0.35)
  Top 0.152: U1.13 45.99,21.69 44.89,20.59 v44.89,19.69 | v26.83,10.59 26.79,10.59 25.64,11.74 24.98,11.74 23.14,9.9 20.1,9.9 19.15,8.95 12.68,8.95 12.64,8.99 12.64,9 11.99,9.65 9.65,9.65 8.66,10.64 8.66,11.48 9.24,12.07 11.01,12.07 11.71,12.76 11.71,13.46 12.6,14.36 COMM_MICRO1.15 | v29.99,7.72 30.94,7.72 31.19,7.47 33.34,7.47 33.95,8.09 35.49,8.09 36.24,8.84 39.39,8.84 41.19,10.64 41.19,11.29 40.44,12.04 40.44,15.97 42.09,17.62 42.47,17.62 43.36,18.51 v43.32,18.56
  Bottom 0.152: v26.83,10.59 29.73,7.69 29.92,7.69 29.96,7.72 v29.99,7.72 | 43.42,18.56 v43.32,18.56 43.76,18.56 v44.89,19.69
!FAULT_2  (via drill 0.35)
  Top 0.152: COMM_MICRO1.26 19.95,13.22 19.79,13.39 v19.79,15.24 | v54.94,19.13 55.29,19.48 55.29,20.59 56.4,21.7 U3.13 | v34.89,7.44 35.39,7.44 36.48,8.53 39.57,8.53 39.94,8.16 40.66,8.16 42.24,9.74 v42.24,12.34
  Bottom 0.152: v19.79,15.24 20.14,15.59 22.74,15.59 23.39,14.94 27.39,14.94 v34.89,7.44 | v42.24,12.34 42.93,13.04 44.07,13.04 50.46,19.43 53.14,19.43 53.44,19.13 v54.94,19.13
!FAULT_3  (via drill 0.35)
  Top 0.152: COMM_MICRO1.43 28.63,18.86 29.52,19.74 29.52,24.55 30.3,25.33 33.24,25.33 33.68,24.9 33.68,19.4 v34.64,18.44 | v65.69,19.09 65.66,19.09 65.43,19.32 65.43,20.98 66.08,21.62 68.03,21.62 U4.13 | v39.54,15.34 37.29,17.59 v37.29,17.7
  Bottom 0.152: v65.69,19.09 59.59,19.09 | 59.59,19.09 59.54,19.14 | 59.59,19.09 55.75,19.09 55.19,18.53 53.61,18.53 53.1,19.04 50.64,19.04 50.28,18.69 50.28,18.48 42.03,10.24 40.23,10.24 38.88,11.59 38.88,13.29 39.54,13.95 v39.54,15.34 | v34.64,18.44 36.55,18.44 v37.29,17.7
+3V3  (via drill 0.35)
  Top 0.152: 37.49,20.5 R16.2 38.64,21.65 38.64,28.04 40.64,30.04 54.43,30.04 55.07,30.68 | R17.2 37.49,32.58 R18.2 37.54,32.64 37.56,32.64 40.95,36.03 | C11.1 | C16.1 8.71,13.98 10.39,13.98 11.72,15.3 v12.24,15.3 13.55,15.3 COMM_MICRO1.13 13.62,15.38 15.85,15.38 16.97,16.5 16.97,19.3 13.6,22.67 | C11.1 11.26,10.01 12.24,10.01 12.97,9.28 16.68,9.28 17.14,9.74 17.14,10.5 16.45,11.19 COMM_MICRO1.19 | COMM_MICRO1.1 13.6,22.67 | 15.84,26.24 C13.1 16.31,26.29 | 15.84,26.24 14.89,26.24 | 14.89,26.24 C15.1 13.6,25.9 13.6,22.67 | 15.84,26.24 15.45,25.85 COMM_MICRO1.64 | COMM_MICRO1.48 25.05,21.61 25.05,29.8 C20.1 | CAN2.3 29.35,26.07 29.86,26.59 29.86,28.31 27.36,30.82 26.14,30.82 | 26.14,30.82 C20.1 | 26.06,30.74 26.14,30.82 | R17.2 34.96,32.79 | v56.64,29.11 55.07,30.68 | 55.07,30.68 55.07,35.26 X1.1 55.01,35.2 55.01,36.36 54.39,36.99 43.66,36.99 42.7,36.03 40.95,36.03 | C20.1 24.51,30.82 R9.2 15.98,32.64 | 15.98,32.64 R8.2 14.89,31.55 14.89,26.24 | 40.95,36.03 38,36.03 35.24,38.79 17.24,38.79 15.92,37.47 15.92,36.59 15.98,36.53 15.98,32.64 | R17.2 34.96,32.41 33.98,31.43 33.98,29.94 34.08,29.84 34.08,23.2 34.02,23.15 34.02,21.48 R15.2 | v12.49,12.09 12.49,12.06 11.52,11.09 C11.1
  Bottom 0.152: C1.1 59.47,26.38 56.74,29.11 v56.64,29.11 56.36,29.39 54.84,29.39 49.71,24.26 49.71,22.82 U$3.4 | v12.24,15.3 12.24,13.44 F1.1 v12.49,12.09 | v12.49,12.09
BOOT  (via drill 0.35)
  Top 0.152: COMM_MICRO1.60 17.45,21.11 v17.5,21.06 | v23,25.13 23,26.02 R6.1 | v25.09,10.99 25.09,10.94 24.93,10.78 v24.93,8.68
  Bottom 0.152: v23,25.13 23,21.25 22.42,20.67 20.76,20.67 20.41,21.01 17.7,21.01 17.65,21.06 v17.5,21.06 17.2,20.76 16.19,20.76 13.46,18.04 13.46,15.29 14.01,14.74 16.09,14.74 16.27,14.92 17.17,14.92 19.48,12.62 23.98,12.62 25.09,11.51 v25.09,10.99 | v24.93,8.68 24.93,7.13 24,6.2 JP1.A13
CAN1_LBK
  Top 0.152: COMM_MICRO1.38 29.21,16.36 32.05,19.19 CAN2.5
CAN1_RX
  Top 0.152: 26.39,24.8 CAN2.4 27.13,24.52 27.13,20.05 26.44,19.36 COMM_MICRO1.44
CAN1_TX
  Top 0.152: CAN2.1 26.11,28.61 25.4,27.9 25.4,24.44 26.76,23.08 26.76,20.39 26.2,19.83 24.83,19.83 COMM_MICRO1.45 24.73,19.93
CAN_H  (via drill 0.35)
  Top 0.152: CAN2.7 32.89,27.34 33.39,27.84 33.39,29.14 30.99,31.54 30.99,37.08 30.04,38.03 v30.04,38.08 | v11.34,8.59 11.74,8.19 14.34,8.19 15.97,6.56 JP1.B7
  Bottom 0.152: v30.04,38.08 28.68,39.44 13.29,39.44 8.69,34.84 8.69,10.89 9.39,10.19 9.74,10.19 v11.34,8.59
CAN_L  (via drill 0.35)
  Top 0.152: 33.04,26.07 CAN2.6 32.73,26.07 33.74,27.09 33.74,29.24 31.59,31.39 31.59,37.74 v31.2,38.13 | JP1.B8 16.97,6.52 v16.56,6.93
  Bottom 0.152: v31.2,38.13 31.2,38.16 29.58,39.77 13.04,39.77 8.38,35.11 8.38,10.72 9.21,9.88 9.44,9.88 10.68,8.64 10.68,8.33 11.29,7.72 11.29,7.29 11.66,6.93 v16.56,6.93
CK  (via drill 0.35)
  Top 0.152: v20.14,24.74 20.26,24.74 20.95,24.05 COMM_MICRO1.53
  Bottom 0.152: U$3.5 50.84,24.69 55.01,28.86 55.76,28.86 58.39,26.24 58.39,23.86 60.56,21.69 61.39,21.69 62.01,22.31 62.01,26.74 60.89,27.86 59.64,27.86 57.64,29.86 54.51,29.86 51.46,26.81 39.51,26.81 36.84,29.49 22.29,29.49 20.14,27.34 v20.14,24.74
CMD  (via drill 0.35)
  Top 0.152: v20.98,21.74 20.45,22.27 COMM_MICRO1.54
  Bottom 0.152: U$3.3 48.64,24.54 46.86,26.31 39.3,26.31 36.52,29.1 22.51,29.1 20.83,27.42 20.83,21.88 v20.98,21.74
CS_1  (via drill 0.35)
  Top 0.152: U1.9 47.19,19.09 v46.74,18.64 | v39.49,12.99 38.99,12.99 35.14,9.14 v29.24,9.14 | COMM_MICRO1.28 20.97,11.98 20.97,11.16 21.9,10.24 23.03,10.24 24.88,12.09 26.29,12.09 26.74,11.64 v26.74,11.54
  Bottom 0.152: v46.74,18.64 41.09,12.99 v39.49,12.99 | v29.24,9.14 26.84,11.54 v26.74,11.54
CS_2  (via drill 0.35)
  Top 0.152: U3.9 57.96,19.13 57.58,19.13 v56.29,17.84 | v39.19,9.54 38.59,10.14 36.59,10.14 35.24,8.79 31.24,8.79 30.84,8.39 29.04,8.39 28.58,8.84 28.58,9.44 28.69,9.54 28.69,12.65 27.48,13.86 COMM_MICRO1.33
  Bottom 0.152: v56.29,17.84 54.89,16.44 53.29,16.44 46.39,9.54 v39.19,9.54
CS_3  (via drill 0.35)
  Top 0.152: COMM_MICRO1.27 20.45,14.03 v20.74,14.33 | v32.14,8.09 33.39,8.09 33.74,8.44 35.39,8.44 36.44,9.49 v37.89,9.49 | v66.79,18.64 67.23,19.07 U4.9
  Bottom 0.152: v32.14,8.09 25.9,14.33 23.04,14.33 22.74,14.63 21.05,14.63 v20.74,14.33 | v37.89,9.49 39.14,8.24 47.19,8.24 52.59,13.64 61.79,13.64 v66.79,18.64
D0  (via drill 0.35)
  Top 0.152: COMM_MICRO1.39 24.91,16.96 25.76,16.96 26.01,16.71 26.61,16.71 26.87,16.96 v28.89,16.96 | v40.51,20.34 40.26,20.09 40.26,17.96 v40.24,17.94
  Bottom 0.152: U$3.7 53.04,21.44 52.36,20.76 47.8,20.76 46.93,21.62 45.4,21.62 45.39,21.61 41.79,21.61 v40.51,20.34 | v40.24,17.94 38.96,16.66 29.19,16.66 v28.89,16.96
D1  (via drill 0.35)
  Top 0.152: COMM_MICRO1.40 24.81,17.36 26.22,17.36 v26.26,17.32 | v39.39,18.36 39.89,18.86 39.89,21.49 39.29,22.09 39.29,28.04 40.59,29.34 54.04,29.34 v55.26,28.11
  Bottom 0.152: v26.26,17.32 27.09,17.32 29.14,19.36 37.19,19.36 38.19,18.36 v39.39,18.36 | v55.26,28.11 55.26,25.74 54.14,24.61 U$3.8
D2  (via drill 0.35)
  Top 0.152: COMM_MICRO1.51 21.95,24.17 21.76,24.36 v21.76,24.56
  Bottom 0.152: U$3.1 46.44,24.54 45.54,25.44 38.81,25.44 36.01,28.24 23.14,28.24 21.76,26.86 v21.76,24.56
D3  (via drill 0.35)
  Top 0.152: v22.01,21.74 21.45,22.3 COMM_MICRO1.52
  Bottom 0.152: v22.01,21.74 21.14,22.61 21.14,27.02 22.78,28.67 36.26,28.67 39.02,25.91 46.49,25.91 47.54,24.86 U$3.2
GB1_1  (via drill 0.35)
  Top 0.152: COMM_MICRO1.50 22.45,24.05 22.89,24.49 v23.78,24.49 | v39.25,21.19 39.49,20.95 39.49,19.64 38.21,18.36 36.65,18.36 35.83,17.55 35.83,17.04 38.83,14.04 39.49,14.04 40.09,13.44 40.09,11.28 v40.49,10.89 | v52.39,11.99 52.01,12.37 v43.21,12.37
  Bottom 0.152: v39.25,21.19 39.2,21.24 39.2,23.88 35.54,27.54 34.54,27.54 31.49,24.49 v23.78,24.49 | v40.49,10.89 41.73,10.89 v43.21,12.37 | SJ3.1 v52.39,11.99
GB1_2  (via drill 0.35)
  Top 0.152: COMM_MICRO1.61 16.83,23.33 16.83,24.1 16.29,24.64 v16.29,24.74 | v53.59,12.04 52.39,10.84 SJ6.2
  Bottom 0.152: v16.29,24.74 15.44,24.74 14.79,24.09 11.79,24.09 11.09,24.79 11.09,35.54 13.94,38.39 27.54,38.39 31.59,34.34 56.64,34.34 67.94,23.04 67.94,18.74 62.39,13.19 54.74,13.19 v53.59,12.04
GB1_3  (via drill 0.35)
  Top 0.152: COMM_MICRO1.62 16.45,21.6 v16.39,21.54
  Bottom 0.152: v16.39,21.54 15.94,21.09 14.23,21.09 10.74,24.59 10.74,35.68 13.79,38.74 27.68,38.74 31.74,34.68 43.04,34.68 43.05,34.69 56.78,34.69 68.29,23.18 68.29,18.44 62.68,12.84 57.44,12.84 55.39,10.79 SJ4.1 55.19,10.84
GB1_4  (via drill 0.35)
  Top 0.152: COMM_MICRO1.2 12.67,20.86 11.94,21.59 11.94,28.73 12.57,29.36 13.76,29.36 14.3,29.89 14.3,35.15 15.39,36.24 15.39,38.69 15.94,39.24 36.09,39.24 v36.09,39.08
  Bottom 0.152: v36.09,39.08 57.85,39.08 68.59,28.34 68.59,18.14 62.89,12.44 59.29,12.44 SJ5.1
GB1_5  (via drill 0.35)
  Top 0.152: COMM_MICRO1.30 21.95,12.94 21.55,13.34 21.55,13.63 21.9,13.99 v21.99,13.99 | v32.49,6.84 32.84,6.48 35.48,6.48 36.64,7.64 38.74,7.64 v38.84,7.54 | SJ7.2 54.34,9.99 v50.69,9.99
  Bottom 0.152: v21.99,13.99 25.34,13.99 v32.49,6.84 | v50.69,9.99 48.24,7.54 v38.84,7.54
GEN_1  (via drill 0.35)
  Top 0.152: COMM_MICRO1.24 18.93,12.03 18.93,12.8 18.59,13.14 17.79,13.14 v17.59,13.34 | X1.10 43.65,35.29 v42.79,35.29
  Bottom 0.152: v17.59,13.34 17.39,13.54 17.39,14.24 17.01,14.62 16.4,14.62 16.21,14.43 13.89,14.43 13.16,15.16 13.16,19.76 10.04,22.88 10.04,35.62 13.51,39.09 27.89,39.09 29.74,37.24 | 29.79,37.24 29.74,37.24 | v42.79,35.29 42.59,35.49 31.49,35.49 29.74,37.24
GND  (via drill 0.35)
  Top 0.152: C10.2 48.58,14.34 v49.24,13.69 | v50.79,15.89 51.15,16.25 C24.2 | C26.2 v59.09,14.35 v59.09,14.34 | v61.09,15.79 61.52,16.22 C29.2 | C6.1 47.8,28.3 v47.84,28.34 | X1.4 51.25,34.35 v47.89,30.99 52.49,30.99 53.75,32.25 X1.2 | v14.64,23.34 14.62,23.32 14.62,22.66 15.26,22.03 15.93,22.03 15.93,23.18 COMM_MICRO1.63 | U4.1 61,22.32 v60.99,22.34 | C11.2 11.29,14.09 v11.39,14.09 | v11.79,16.14 12.34,16.14 12.64,15.84 13.58,15.84 COMM_MICRO1.12 | U$2.P$1 8.02,15.84 v6.79,15.84
  Bottom 0.152: v50.79,15.89 50.79,14.44 50.04,13.69 v49.24,13.69 | v59.09,14.34 60.53,15.79 v61.09,15.79 | v47.84,28.34 47.84,30.94 v47.89,30.99 | v11.39,14.09 11.39,15.74 v11.79,16.14
  other vias: 67.89,10.44 10.94,6.29 23.54,34.89 4.24,35.59 64.89,28.59 13.19,34.79 24.09,27.59 28.89,26.84 15.89,29.44 12.74,24.74 12.84,23.44 50.99,21.39 10.99,19.99 26.14,20.84 27.84,21.24 28.94,25.29 43.79,14.34 41.19,12.34 40.39,8.89 35.49,12.14 15.44,13.79 67.79,12.84 6.79,14.29 27.64,31.49 45.44,22.34 41.09,22.39 16.19,10.19 23.64,11.99
  pour Top: -3.06,40.24 -3.06,10.14 8.29,-1.21 62.99,-1.21 71.64,7.44 71.64,40.99 68.64,43.99 0.69,43.99
  pour Bottom: -4.31,40.19 -4.31,9.84 7.24,-1.71 65.04,-1.71 72.34,5.59 72.34,41.54 69.04,44.84 0.34,44.84
MISO_BUS  (via drill 0.35)
  Top 0.152: COMM_MICRO1.22 17.95,10.77 18.81,9.91 v19.16,9.91 | v27.04,6.34 26,5.3 JP1.B15
  Bottom 0.152: v27.04,6.34 27.44,6.74 27.44,7.99 25.44,9.99 24.69,9.99 23.71,10.97 23.09,10.97 22.42,11.64 20.88,11.64 v19.16,9.91
MISO_SENSOR  (via drill 0.35)
  Top 0.152: U1.12 48.06,21.02 v46.68,21.02 | v56.59,21.02 57.96,21.02 U3.12 | v66.75,21.02 U4.12 | COMM_MICRO1.10 16.13,16.86 v16.36,17.08
  Bottom 0.152: v66.75,21.02 v56.59,21.02 55.69,21.02 55.09,20.42 47.33,20.42 46.73,21.02 v46.68,21.02 45.24,21.02 44.5,20.28 41.45,20.28 40.91,19.73 | v16.36,17.08 17.8,18.52 27.74,18.52 28.95,19.73 40.91,19.73 | 40.91,19.73 40.89,19.71
MOSI_BUS  (via drill 0.35)
  Top 0.152: v20.69,10.56 20.69,10.52 18.91,10.52 18.45,10.97 COMM_MICRO1.23
  Bottom 0.152: v20.69,10.56 23.64,10.56 24.52,9.68 25.3,9.68 25.99,8.99 25.99,6.33 25,5.34 JP1.A14
MOSI_SENSOR  (via drill 0.35)
  Top 0.152: U1.11 48.07,20.38 v46.04,20.38 | v55.95,20.38 55.97,20.4 U3.11 | v66.04,20.38 U4.11 | COMM_MICRO1.11 15.6,16.36 v15.79,16.17
  Bottom 0.152: v66.04,20.38 v55.95,20.38 55.65,20.07 47.24,20.07 46.94,20.38 v46.04,20.38 45.72,20.05 45.72,19.32 42.72,16.32 26.14,16.32 24.32,18.14 18.59,18.14 16.62,16.17 16.59,16.17 | v15.79,16.17 16.59,16.17 | 16.69,16.27 16.59,16.17
N$1  (via drill 0.35)
  Top 0.152: v50.99,7.14 48.94,9.19 SJ9.1 SJ10.1
  Bottom 0.152: JP1.A40 51,7.13 | 51,7.13 v50.99,7.14 | JP1.A43 54,5.78 52.65,7.13 51,7.13
N$2
  Bottom 0.152: JP1.A47 58,6.33 SJ4.2
N$3
  Top 0.152: COMM_MICRO1.36 29.52,15.36 30.59,16.43 LED3.A
N$4
  Top 0.152: 31.55,14.51 LED3.C 31.33,14.28 R2.2
N$5  (via drill 0.35)
  Top 0.152: JP1.B3 v11.97,6.29 v11.97,7.54
  Bottom 0.152: v11.97,7.54 11.97,9.34 10.36,10.96 F2.2 | JP1.B3 v11.97,6.29
N$6
  Top 0.152: 33.6,16.76 LED2.A | LED2.A 33.9,16.42 | COMM_MICRO1.37 29.25,15.86 30.67,17.27 33.23,17.27 33.9,16.6 LED2.A
N$7
  Top 0.152: R7.2 33.84,14.29 LED2.C
N$8  (via drill 0.35)
  Top 0.152: JP1.B5 v13.97,6.29 13.97,7.56 v13.95,7.58
  Bottom 0.152: 14,3.63 JP1.B5 v13.97,6.29 | v13.95,7.58 13.95,9.53 F1.2
N$9
  Top 0.152: JP1.B46 57,5.19 | 52.5,9.08 SJ6.1 53.24,9.19 57,5.43 JP1.B46 | JP1.B46 57,5.44
N$10
  Top 0.152: 12.83,20.36 COMM_MICRO1.3 12.55,20.36 11.47,21.43 11.47,25.53 Y2.P$1 10.36,27.83 C18.2
N$11
  Top 0.152: 12.83,19.86 COMM_MICRO1.4 12.3,19.86 11.15,21.01 11.15,24.34 10.8,24.68 9.12,24.68 Y2.P$4 7.16,27.99 C19.2
N$12
  Top 0.152: SJ1.1 17.95,25.52 COMM_MICRO1.59
N$13
  Top 0.152: SJ2.1 20.32,25.85 18.45,23.98 COMM_MICRO1.58
N$14
  Top 0.152: CAN2.8 31.47,28.61 R11.2
N$15
  Top 0.152: 55.39,9.19 SJ7.1 | 58,5.19 JP1.B47 58,6.33 SJ7.1 | 55.14,8.94 SJ7.1
N$16
  Top 0.152: 59,5.33 JP1.B48 59,7.83 SJ8.1 57.64,8.94
N$17
  Bottom 0.152: 57.64,8.94 SJ5.2 59,7.83 JP1.A48
N$20
  Bottom 0.152: 57,5.44 JP1.A46 57,5.43 53.24,9.19 SJ3.2
NRST  (via drill 0.35)
  Top 0.152: COMM_MICRO1.7 11.92,18.36 10.6,17.04 10.6,15.06 10.47,14.93 5.18,14.93 S2.2 5.28,14.82 C17.2 5.28,13.11 4.21,12.04 4.21,10.36 5.04,9.53 9.24,9.53 9.54,9.24 11.74,9.24 12.41,8.56 19.24,8.56 20.27,9.59 22.29,9.59 23.64,8.24 v23.64,6.94
  Bottom 0.152: JP1.A12 23,5.4 23.64,6.04 v23.64,6.94
OSC_IN
  Top 0.152: 12.8,19.36 COMM_MICRO1.5 11.97,19.36 10.29,17.68 8.72,17.68 8.04,18.36 U$2.P$2 8.04,19.6 C21.1
OSC_OUT
  Top 0.152: C22.1 7.69,21.13 6.96,20.41 6.96,17.7 7.45,17.21 8.64,17.21 9.74,16.11 | COMM_MICRO1.6 11.93,18.86 9.74,16.66 9.74,16.11 | U$2.P$3 9.74,15.94 9.74,16.11
PRESSURE_OUT  (via drill 0.35)
  Top 0.152: COMM_MICRO1.14 15.81,14.86 17.89,16.94 17.89,18.84 13.94,22.79 13.94,24.29 v14.39,24.74 | v45.39,32.04 47.5,34.15 X1.7
  Bottom 0.152: v14.39,24.74 19.54,29.89 37.14,29.89 39.79,27.24 44.09,27.24 45.39,28.54 v45.39,32.04
PWM_1
  Top 0.152: SJ10.2 44.7,10.79 40.85,6.93 38.59,6.93 38.28,7.24 36.71,7.24 35.64,6.17 30.66,6.17 28.18,8.65 28.18,9.59 28.34,9.75 28.34,12.22 27.14,13.42 23.97,13.42 23.69,13.7 23.69,14.35 21.39,16.65 21.39,18.64 20.63,19.39 19.69,19.39 19.37,19.71 19.37,23.12 COMM_MICRO1.56
PWM_2
  Top 0.152: SJ9.2 47.09,9.99 44.48,9.99 41.12,6.63 38.46,6.63 38.2,6.89 36.79,6.89 35.74,5.84 30.48,5.84 27.77,8.55 27.77,9.89 27.94,10.05 27.94,11.96 26.81,13.09 23.84,13.09 23.34,13.59 23.34,14.24 21.04,16.54 21.04,18.24 20.31,18.96 19.46,18.96 18.95,19.48 COMM_MICRO1.57
SCL_2  (via drill 0.35)
  Top 0.152: 48.72,35.16 X1.6 48.75,34.4 45.4,31.06 40.25,31.06 36.96,27.77 36.96,26.14 v35,24.18 R15.1 | COMM_MICRO1.34 29.74,14.36 30.61,15.23 32.19,15.23 32.2,15.24 34.9,15.24 35.24,15.58 35.24,17.54 36.38,18.68 37.94,18.68 38.81,19.56 v38.81,20.34
  Bottom 0.152: v38.81,20.34 38.81,20.37 v35,24.18
SCL_3  (via drill 0.35)
  Top 0.152: 44.91,35.1 X1.9 45,34.27 42.6,31.87 38.7,31.87 38.41,31.59 36.62,31.59 36.27,31.24 36.27,28.17 36.18,28.08 v34.98,26.88 34.96,26.91 R17.1 | COMM_MICRO1.8 15.17,17.86 v16.36,19.05
  Bottom 0.152: 16.46,19.05 v16.36,19.05 16.67,19.36 26.86,19.36 34.38,26.88 v34.98,26.88
SCL_BUS  (via drill 0.35)
  Top 0.152: v23.37,17.05 23.37,19.6 22.86,20.11 22.86,20.71 24.73,22.58 24.73,28.11 23.53,29.31 21.89,29.31 20.34,27.76 SJ2.2 20.34,28.4 R9.1 | JP1.B27 38,6.23 v37.99,6.24
  Bottom 0.152: v23.37,17.05 24.73,15.69 28.54,15.69 v37.99,6.24
SCLK_BUS  (via drill 0.35)
  Top 0.152: COMM_MICRO1.21 17.45,10.63 17.47,10.61 17.47,10.31 v18.22,9.56 | v25.34,6.59 25,6.25 JP1.B14
  Bottom 0.152: v18.22,9.56 18.52,9.26 19.42,9.26 20.07,9.9 23.77,9.9 24.3,9.37 25.1,9.37 25.59,8.89 25.59,6.84 v25.34,6.59
SCLK_SENSOR  (via drill 0.35)
  Top 0.152: v56.6,19.74 56.61,19.75 U3.10 | v66.75,19.75 68.05,19.75 U4.10 | v19.55,16.51 19.55,16.41 21.35,14.61 21.35,14.04 21.04,13.72 21.04,13.3 21.45,12.89 COMM_MICRO1.29 | U1.10 v46.69,19.74
  Bottom 0.152: v66.75,19.75 v66.74,19.74 v56.6,19.74 v46.69,19.74 42.96,16 25.72,16 23.99,17.74 19.98,17.74 19.55,17.31 v19.55,16.51 | v19.55,16.51
SDA_2
  Top 0.152: X1.5 50,34.44 46.21,30.65 40.58,30.65 37.52,27.58 R16.1 36.27,21.19 36.27,19.19 34.89,17.8 34.89,15.84 34.59,15.54 30.35,15.54 29.66,14.86 COMM_MICRO1.35
SDA_3  (via drill 0.35)
  Top 0.152: 46.18,35.12 X1.8 46.25,34.3 43.42,31.47 40,31.47 37.51,28.98 | COMM_MICRO1.9 15.68,17.36 v16.36,18.03 | R18.1 37.51,28.98 | v35.94,26.11 36.54,26.71 36.54,28 37.51,28.98
  Bottom 0.152: 16.46,18.03 v16.36,18.03 17.27,18.94 27.52,18.94 34.69,26.11 v35.94,26.11
SDA_BUS  (via drill 0.35)
  Top 0.152: v22.68,16.25 22.68,19.65 22.45,19.88 22.45,20.73 24.39,22.67 24.39,26.39 23.49,27.29 21.92,27.29 21.7,27.07 21.7,27.04 21.34,26.68 19.25,26.68 18.34,27.58 SJ1.2 18.34,28.29 R8.1 | JP1.B26 37,6.23 v36.99,6.23
  Bottom 0.152: v22.68,16.25 23.6,15.34 27.89,15.34 v36.99,6.23
SS_BUS  (via drill 0.35)
  Top 0.152: COMM_MICRO1.20 16.95,12.94 16.09,13.8 16.09,14.65 18.56,17.12 19.81,17.12 22.99,13.94 22.99,13.44 23.69,12.74 26.59,12.74 27.59,11.74 27.59,10.39 27.34,10.14 27.34,8.34 26.77,7.77 v26.77,7.75
  Bottom 0.152: JP1.A15 26,5.34 26.37,5.7 26.37,7.35 v26.77,7.75
SWCLK  (via drill 0.35)
  Top 0.152: COMM_MICRO1.49 22.95,21.74 21.99,20.78 v21.99,17.05 | v18.23,15.89 16.76,14.42 v16.76,14.01 | JP1.B11 19.97,6.33 v18.87,7.43
  Bottom 0.152: v21.99,17.05 v21.99,17.04 20.85,15.91 v18.25,15.91 v18.23,15.89 | v16.76,14.01 16.76,13.91 15.39,12.54 15.39,9.94 16.04,9.29 17.04,9.29 18.87,7.46 v18.87,7.43
SWDIO  (via drill 0.35)
  Top 0.152: v23.46,20.36 COMM_MICRO1.46 | JP1.B12 23,5.4 24.29,6.69 24.29,8.45 23.59,9.15 v23.59,9.19
  Bottom 0.152: v23.46,20.36 20.56,20.36 20.26,20.66 19.59,20.66 19.34,20.41 16.31,20.41 13.89,17.99 13.89,15.54 14.34,15.09 15.99,15.09 16.16,15.26 16.17,15.26 17.27,15.26 19.55,12.98 24.25,12.98 25.74,11.49 25.74,10.74 25.34,10.34 24.79,10.34 23.84,11.29 23.34,11.29 22.64,11.99 19.01,11.99 17.46,10.44 17.46,9.44 18.21,8.69 19.37,8.69 20.27,9.59 23.19,9.59 v23.59,9.19 23.59,9.14
SWO  (via drill 0.35)
  Top 0.152: v26.66,9.64 26.66,8.84 24.63,6.8 24.63,6.21 24,5.59 JP1.B13 | v20.01,20.04 20.41,20.44 20.41,21.45 19.95,21.91 COMM_MICRO1.55
  Bottom 0.152: v26.66,9.64 26.11,10.19 26.11,11.71 24.49,13.33 19.64,13.33 17.41,15.57 16.04,15.57 16.03,15.57 15.99,15.53 15.58,15.53 15.04,16.06 15.04,18.71 16.37,20.04 v20.01,20.04
T1+
  Top 0.152: C7.2 44.72,23.88 44.72,22.25 42.86,20.39 U1.4 | C8.1 42.78,14.34 43.74,15.3 45.95,15.3 46.22,15.57 46.22,17.03 42.83,20.42 42.27,20.42 U1.4 | U1.4 41.34,20.39 40.28,21.45 R4.2
T1-
  Top 0.152: U1.3 42.26,21.05 42.97,21.05 43.47,21.55 43.47,23.9 R3.2 43.65,24.53 44.07,24.95 44.07,25.8 44.7,26.43 C7.1 46.09,26.43 46.62,25.9 46.62,24.9 47.09,24.43 C6.2
T2+
  Top 0.152: C23.2 54.62,23.89 54.62,22.21 52.81,20.4 | 52.81,20.4 U3.4 50.66,20.4 50.19,20.88 R12.2 | C24.1 53.16,14.35 54.12,15.31 55.85,15.31 56.12,15.58 56.12,17.09 52.81,20.4
T2-
  Top 0.152: U3.3 52.16,21.06 52.87,21.06 53.37,21.56 53.37,23.91 R5.2 53.55,24.54 53.97,24.96 53.97,25.81 54.6,26.44 C23.1 55.99,26.44 56.52,25.91 56.52,24.91 56.99,24.44 C14.2
T3+
  Top 0.152: C28.2 64.71,23.86 64.71,21.54 63.55,20.38 | 63.55,20.38 U4.4 61.42,20.38 60.27,21.52 R14.2 | C29.1 63.25,14.32 64.21,15.29 65.94,15.29 66.21,15.55 66.21,17.71 63.55,20.38
T3-
  Top 0.152: U4.3 62.25,21.04 62.96,21.04 63.46,21.54 63.46,23.88 R13.2 63.64,24.52 64.06,24.93 64.06,25.79 64.69,26.41 C28.1 66.08,26.41 66.61,25.88 66.61,24.88 67.08,24.41 C27.2
THERM1+  (via drill 0.35)
  Top 0.152: R4.1 40.14,26.54 v40.14,27.99
  Bottom 0.152: X2.1 14.37,36.92 19.08,32.21 35.91,32.21 v40.14,27.99
THERM1-  (via drill 0.35)
  Top 0.152: U1.2 42.81,21.69 43.07,21.95 43.07,23 42.77,23.3 42.12,23.3 41.77,23.65 41.77,25.96 42.24,26.43 R3.1 42.84,27.79 v42.04,28.59
  Bottom 0.152: X2.2 21,32.91 37.72,32.91 v42.04,28.59
THERM2+  (via drill 0.35)
  Top 0.152: R12.1 50.06,26.54 v50.06,28.34
  Bottom 0.152: X3.1 27.26,33.28 47.52,33.28 50.06,30.74 v50.06,28.34
THERM2-  (via drill 0.35)
  Top 0.152: U3.2 52.2,21.65 52.66,21.65 52.97,21.96 52.97,23.01 52.67,23.31 52.02,23.31 51.55,23.79 51.55,25.85 52.14,26.44 R5.1 52.64,26.34 52.64,27.21 v51.46,28.39
  Bottom 0.152: X3.2 29.32,33.76 49.69,33.76 51.46,31.99 v51.46,28.39
THERM3+  (via drill 0.35)
  Top 0.152: R14.1 60.27,26.39 60.74,26.86 v60.74,32.01
  Bottom 0.152: X4.1 33.85,35.94 56.81,35.94 v60.74,32.01
THERM3-  (via drill 0.35)
  Top 0.152: U4.2 62.8,21.68 63.06,21.93 63.06,22.98 62.76,23.29 62.11,23.29 61.76,23.63 61.76,25.95 62.23,26.41 R13.1 62.98,26.57 62.98,30.83 62.94,30.87 v62.94,31.94
  Bottom 0.152: X4.2 35.39,36.99 35.83,36.55 58.32,36.55 v62.94,31.94
UART_RX  (via drill 0.35)
  Top 0.152: COMM_MICRO1.17 14.72,11.27 v14.74,11.24
  Bottom 0.152: v14.74,11.24 14.74,10.03 15.84,8.94 16.74,8.94 17.74,7.94 17.74,6.34 16.97,5.57 JP1.A8
UART_TX  (via drill 0.35)
  Top 0.152: COMM_MICRO1.16 13.86,13.86 v13.86,13.14
  Bottom 0.152: v13.86,13.14 14.06,12.94 14.06,10.21 15.69,8.59 16.34,8.59 17.29,7.64 17.29,6.64 15.97,5.32 JP1.A7

### Text on the board
tNames: R8 | Varela board | R15 | G:/Zenith/GENUS/Logo.bmp